# EAGLE design arduino-breadboard (EAGLE 6.6.0)
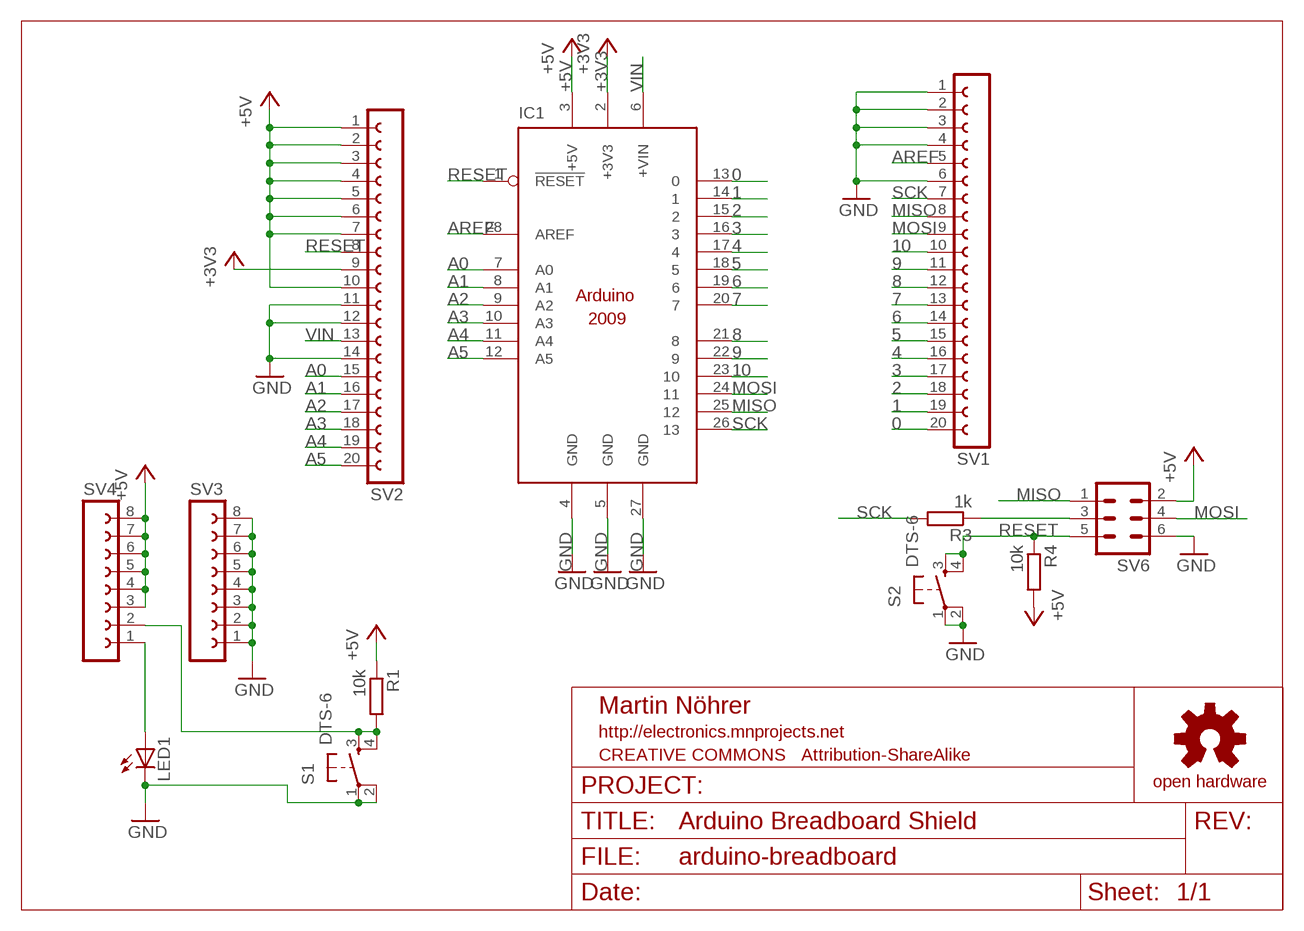
[diagram p0: schematic, sheet 1]

## Parts
IC1  ARDUINO2009_12  [ARDUINO2009_2]
LED1  LED5MM  [LED5MM]
R1  10k  R-EU_0207/10  [0207/10]
R3  1k  R-EU_0207/10  [0207/10]
R4  10k  R-EU_0207/10  [0207/10]
S1  DTS-6  [DTS-6]
S2  DTS-6  [DTS-6]
SV1  FE20-1  [FE20]
SV2  FE20-1  [FE20]
SV3  FE08-1  [FE08]
SV4  FE08-1  [FE08]
SV6  MA03-2  [MA03-2]

## Nets
0: IC1.13 SV1.20
1: IC1.14 SV1.19
2: IC1.15 SV1.18
3: IC1.16 SV1.17
4: IC1.17 SV1.16
5: IC1.18 SV1.15
6: IC1.19 SV1.14
7: IC1.20 SV1.13
8: IC1.21 SV1.12
9: IC1.22 SV1.11
10: IC1.23 SV1.10
+3V3: IC1.2(+3V3) SV2.9
+5V: IC1.3(+5V) R1.1 R4.2 SV2.1 SV2.2 SV2.3 SV2.4 SV2.5 SV2.6 SV2.7 SV2.10 SV4.3 SV4.4 SV4.5 SV4.6 SV4.7 SV4.8 SV6.2
A0: IC1.7(A0) SV2.15
A1: IC1.8(A1) SV2.16
A2: IC1.9(A2) SV2.17
A3: IC1.10(A3) SV2.18
A4: IC1.11(A4) SV2.19
A5: IC1.12(A5) SV2.20
AREF: IC1.28(AREF) SV1.5
GND: IC1.4(GND) IC1.5(GND) IC1.27(GND) LED1.K(C) S1.1 S1.2 S2.1 S2.2 SV1.1 SV1.2 SV1.3 SV1.4 SV1.6 SV2.11 SV2.12 SV2.14 SV3.1 SV3.2 SV3.3 SV3.4 SV3.5 SV3.6 SV3.7 SV3.8 SV6.6
MISO: IC1.25 SV1.8 SV6.1
MOSI: IC1.24 SV1.9 SV6.4
N$1: LED1.A SV4.1
N$4: R3.1 SV6.3
N$7: R1.2 S1.3 S1.4 SV4.2
RESET: IC1.1(!RESET) R4.1 S2.3 S2.4 SV2.8 SV6.5
SCK: IC1.26 R3.2 SV1.7
VIN: IC1.6(+VIN) SV2.13

## Notes on the sheet
- Arduino Breadboard Shield

## Library data of the parts
IC1 = arduino:ARDUINO2009_1: The Arduino Duemilanove ("2009") is a microcontroller board based on the ATmega168 or ATmega328. - 14 digital input/output pins (of which 6 can be used as PWM outputs) - 6 analog inputs, a 16 MHz crystal oscillator - USB connection - power jack - ISP header - reset button It contains everything needed to support the microcontroller; simply connect it to a computer with a USB cable or power it with a AC-to-DC adapter or battery to get started http://arduino.cc/en/Main/ArduinoBoardDuemilanove
LED1 = led:LED: LED OSRAM: - CHIPLED LG R971, LG N971, LY N971, LG Q971, LY Q971, LO R971, LY R971 LH N974, LH R974 LS Q976, LO Q976, LY Q976 LO Q996 - Hyper CHIPLED LW Q18S LB Q993, LB Q99A, LB R99A - SideLED LS A670, LO A670, LY A670, LG A670, LP A670 LB A673, LV A673, LT A673, LW A673 LH A674 LY A675 LS A676, LA A676, LO A676, LY A676, LW A676 LS A679, LY A679, LG A679 - Hyper Micro SIDELED® LS Y876, LA Y876, LO Y876, LY Y876 LT Y87S - SmartLED LW L88C, LW L88S LB L89C, LB L89S, LG L890 LS L89K, LO L89K, LY L89K LS L896, LA L896, LO L896, LY L896 - TOPLED LS T670, LO T670, LY T670, LG T670, LP T670 LSG T670, LSP T670, LSY T670, LOP T670, LYG T670 LG T671, LOG T671, LSG T671 LB T673, LV T673, LT T673, LW T673 LH T674 LS T676, LA T676, LO T676, LY T676, LB T676, LH T676, LSB T676, LW T676 LB T67C, LV T67C, LT T67C, LS T67K, LO T67K, LY T67K, LW E67C LS E67B, LA E67B, LO E67B, LY E67B, LB E67C, LV E67C, LT E67C LW T67C LS T679, LY T679, LG T679 LS T770, LO T770, LY T770, LG T770, LP T770 LB T773, LV T773, LT T773, LW T773 LH T774 LS E675, LA E675, LY E675, LS T675 LS T776, LA T776, LO T776, LY T776, LB T776 LHGB T686 LT T68C, LB T68C - Hyper Mini TOPLED® LB M676 - Mini TOPLED Santana® LG M470 LS M47K, LO M47K, LY M47K Source: http://www.osram.convergy.de LUXEON: - LUMILED® LXK2-PW12-R00, LXK2-PW12-S00, LXK2-PW14-U00, LXK2-PW14-V00 LXK2-PM12-R00, LXK2-PM12-S00, LXK2-PM14-U00 LXK2-PE12-Q00, LXK2-PE12-R00, LXK2-PE12-S00, LXK2-PE14-T00, LXK2-PE14-U00 LXK2-PB12-K00, LXK2-PB12-L00, LXK2-PB12-M00, LXK2-PB14-N00, LXK2-PB14-P00, LXK2-PB14-Q00 LXK2-PR12-L00, LXK2-PR12-M00, LXK2-PR14-Q00, LXK2-PR14-R00 LXK2-PD12-Q00, LXK2-PD12-R00, LXK2-PD12-S00 LXK2-PH12-R00, LXK2-PH12-S00 LXK2-PL12-P00, LXK2-PL12-Q00, LXK2-PL12-R00 Source: www.luxeon.com KINGBRIGHT: KA-3528ASYC Source: www.kingbright.com
R1 R3 R4 = rcl:R-EU_: RESISTOR, European symbol
S1 S2 = switch-tact:DTS-6
SV1 SV2 = con-lsta:FE20-1: FEMALE HEADER
SV3 SV4 = con-lsta:FE08-1: FEMALE HEADER
SV6 = con-lstb:MA03-2: PIN HEADER

## Board
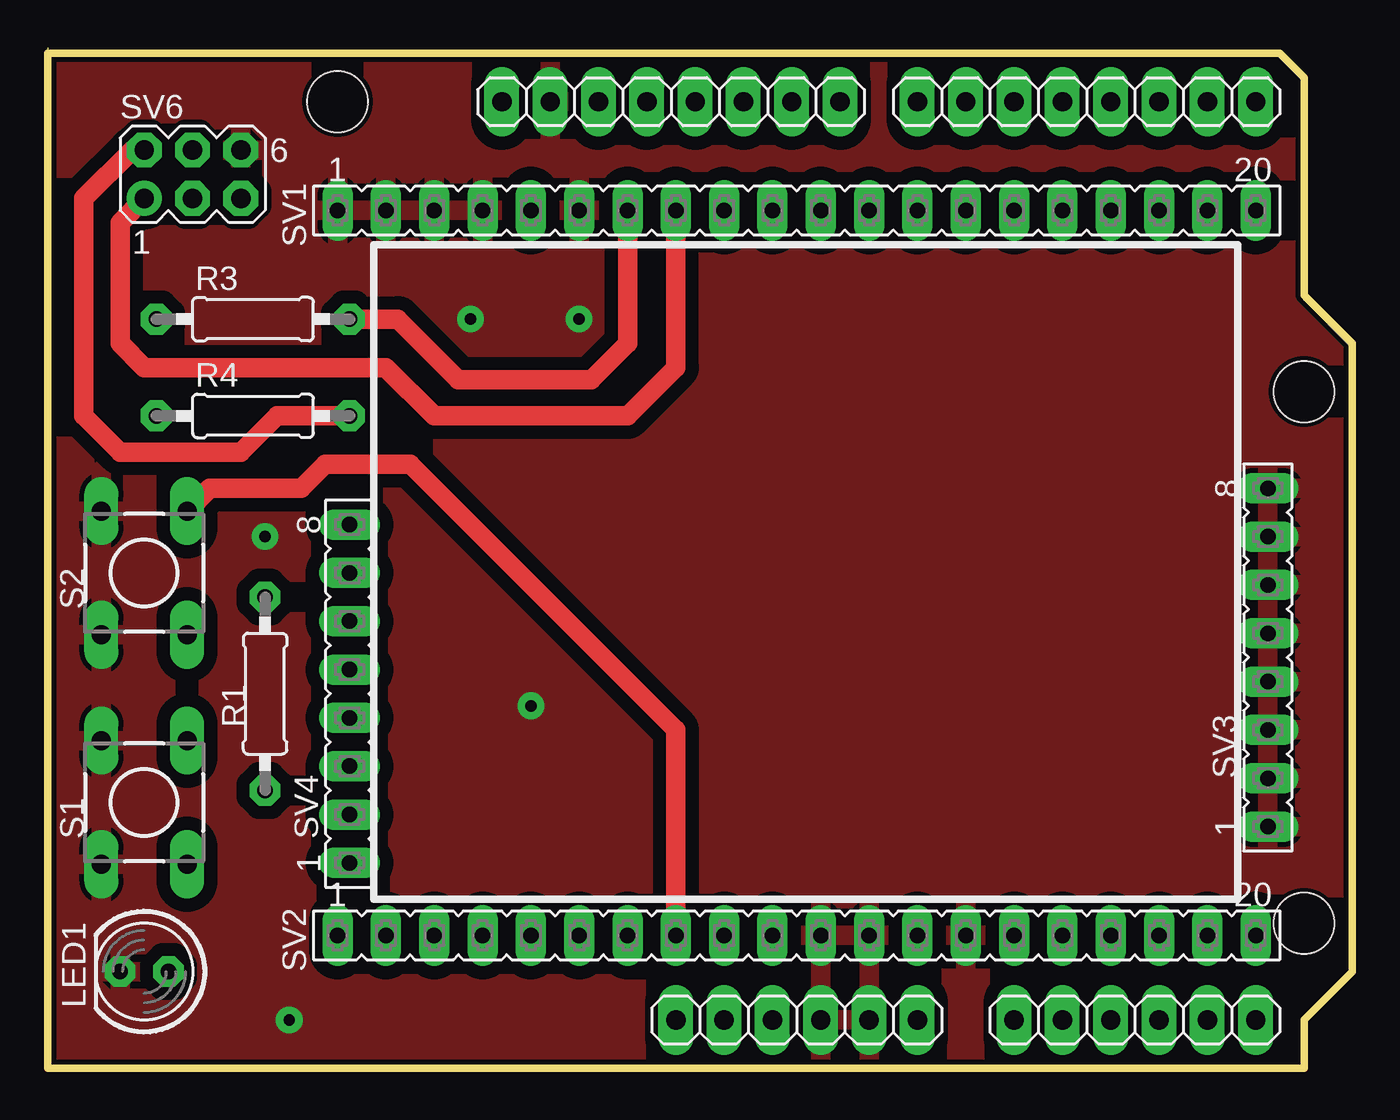
[diagram p1: board, top side]
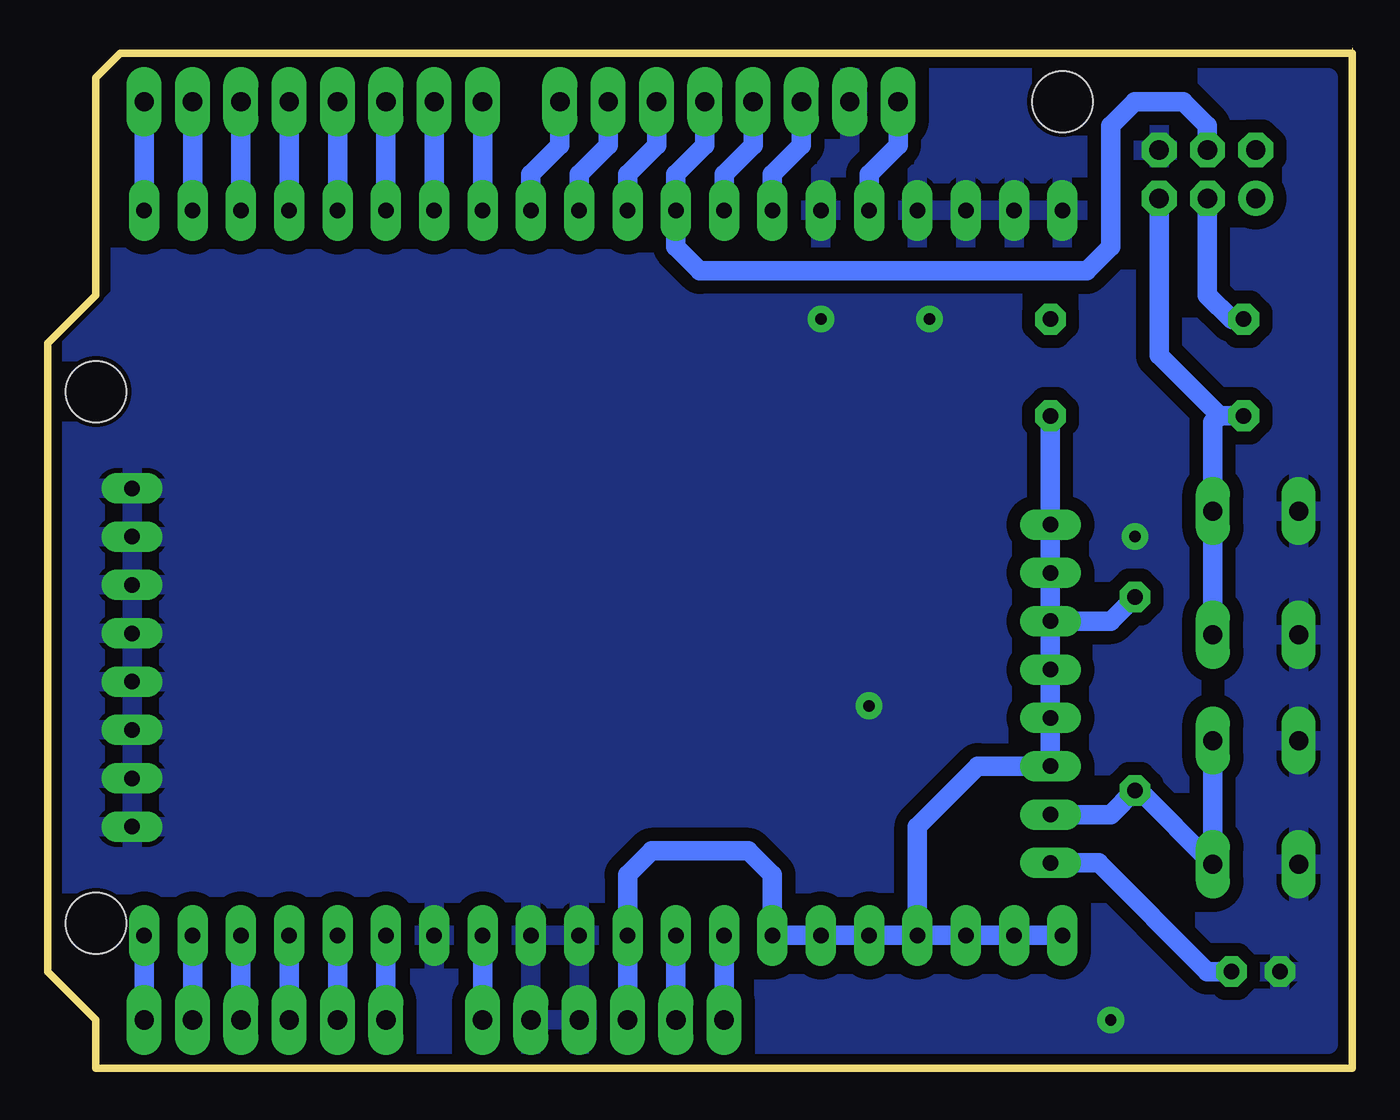
[diagram p2: board, bottom side, seen from below]

Size 68.58 x 53.65 mm. Coordinates in mm from the lower left corner, seen from the top.
Outline: 0,53.65 0,53.34
Outline: 0,53.34 64.77,53.34 66.04,52.07 66.04,40.64 68.58,38.1 68.58,5.08 66.04,2.54 66.04,0 0,0 0,53.34
Copper layers (1*16): Top 0.035mm / dielectric 1.5mm / Bottom 0.035mm
Design rules "hobby2": minimum track width 0.8mm, minimum drill 0.8mm, track to track 0.7mm, track to pad 0.7mm, pad to pad 0.45mm, via to via 0.7mm, smd to smd 8mil, copper to edge 10mil, drill to drill 8mil, minimum pad ring 0.4mm, minimum via ring 0.4mm, stop-mask expansion 0mil, vias tented up to drill 0mil, thermal gap 10mil

### Footprints (pad centres in the part's own frame; a part is rotated, then mirrored left to right if it is on the bottom)
ARDUINO2009_2 = drill 1.016 long: 1 33.02,2.54; 2 35.56,2.54; 3 38.1,2.54; 4 40.64,2.54; 5 43.18,2.54; 6 45.72,2.54; 7 50.8,2.54; 8 53.34,2.54; 9 55.88,2.54; 10 58.42,2.54; 11 60.96,2.54; 12 63.5,2.54; 13 63.5,50.8; 14 60.96,50.8; 15 58.42,50.8; 16 55.88,50.8; 17 53.34,50.8; 18 50.8,50.8; 19 48.26,50.8; 20 45.72,50.8; 21 41.656,50.8; 22 39.116,50.8; 23 36.576,50.8; 24 34.036,50.8; 25 31.496,50.8; 26 28.956,50.8; 27 26.416,50.8; 28 23.876,50.8 | hole 3.2: 15.24,50.8; 66.04,35.56; 66.04,7.62
LED5MM = drill 0.813 octagon: A -1.27,0; K 1.27,0
0207/10 = drill 0.813 octagon: 1 -5.08,0; 2 5.08,0
DTS-6 = drill 1 long: 1 -3.25,2.25; 2 3.25,2.25; 3 -3.25,-2.25; 4 3.25,-2.25
FE20 = drill 0.813 long: 1 -24.13,0; 2 -21.59,0; 3 -19.05,0; 4 -16.51,0; 5 -13.97,0; 6 -11.43,0; 7 -8.89,0; 8 -6.35,0; 9 -3.81,0; 10 -1.27,0; 11 1.27,0; 12 3.81,0; 13 6.35,0; 14 8.89,0; 15 11.43,0; 16 13.97,0; 17 16.51,0; 18 19.05,0; 19 21.59,0; 20 24.13,0
FE08 = drill 0.813 long: 1 -8.89,0; 2 -6.35,0; 3 -3.81,0; 4 -1.27,0; 5 1.27,0; 6 3.81,0; 7 6.35,0; 8 8.89,0
MA03-2 = drill 1.016: 1 -2.54,-1.27 | drill 1.016 octagon: 2 -2.54,1.27; 3 0,-1.27; 4 0,1.27; 5 2.54,-1.27; 6 2.54,1.27

### Placement (x,y rotation side)
IC1  0,0 0 top
LED1  5.08,5.08 180 top
R1  11.43,19.68 270 top
R3  10.79,39.37 0 top
R4  10.79,34.29 0 top
S1  5.08,13.97 90 top
S2  5.08,26.04 90 top
SV1  39.37,45.09 0 top
SV2  39.37,6.99 0 top
SV3  64.14,21.59 90 top
SV4  15.88,19.68 90 top
SV6  7.62,46.99 0 top

### Tracks (layer width: path | path; a pad name or v marks a point on that pad's centre or on a via)
0
  Bottom 1.016: SV1.20 IC1.13
1
  Bottom 1.016: SV1.19 IC1.14
2
  Bottom 1.016: SV1.18 IC1.15
3
  Bottom 1.016: SV1.17 IC1.16
4
  Bottom 1.016: SV1.16 IC1.17
5
  Bottom 1.016: SV1.15 IC1.18
6
  Bottom 1.016: SV1.14 IC1.19
7
  Bottom 1.016: SV1.13 IC1.20
8
  Bottom 1.016: IC1.21 41.66,48.51 43.18,46.99 SV1.12
9
  Bottom 1.016: IC1.22 39.12,48.51 40.64,46.99 SV1.11
10
  Bottom 1.016: IC1.23 36.58,48.51 38.1,46.99 SV1.10
+3V3
  Bottom 1.016: IC1.2 SV2.9
+5V
  Top 1.016: SV6.2 4.45,48.26 1.91,45.72 1.91,34.29 3.81,32.38 10.16,32.38 12.06,34.29 R4.2
  Bottom 1.016: IC1.3 SV2.10 38.1,10.16 36.83,11.43 31.75,11.43 30.48,10.16 SV2.7 SV2.6 SV2.5 SV2.4 | SV2.4 SV2.3 SV2.2 SV2.1 | SV4.6 SV4.5 SV4.4 SV4.3 19.68,15.88 22.86,12.7 SV2.4 | SV4.6 SV4.7 SV4.8 R4.2 | R1.1 12.7,23.5 SV4.6
A0
  Bottom 1.016: IC1.7 SV2.15
A1
  Bottom 1.016: IC1.8 SV2.16
A2
  Bottom 1.016: IC1.9 SV2.17
A3
  Bottom 1.016: IC1.10 SV2.18
A4
  Bottom 1.016: IC1.11 SV2.19
A5
  Bottom 1.016: IC1.12 SV2.20
AREF
  Bottom 1.016: IC1.28 23.88,48.51 25.4,46.99 SV1.5
GND  (via drill 0.6)
  other vias: 12.7,2.54 25.4,19.05 11.43,27.94 22.23,39.37 27.94,39.37
  pour Bottom: 1.27,52.07 64.77,52.07 64.77,40.64 67.31,38.1 67.31,1.27 1.27,1.27
  pour Top: 0,53.34 64.77,53.34 66.04,52.07 66.04,40.64 68.58,38.1 68.58,5.08 66.04,2.54 66.04,0 0,0
MISO
  Top 1.016: SV6.1 3.81,44.45 3.81,38.1 5.08,36.83 17.78,36.83 20.32,34.29 30.48,34.29 33.02,36.83 SV1.8
  Bottom 1.016: SV1.8 33.02,46.99 31.5,48.51 IC1.25
MOSI
  Bottom 1.016: IC1.24 34.04,48.51 35.56,46.99 SV1.9 35.56,43.18 34.29,41.91 13.97,41.91 12.7,43.18 12.7,49.53 11.43,50.8 8.89,50.8 7.62,49.53 SV6.4
N$1
  Bottom 1.016: SV4.1 13.34,10.79 7.62,5.08 LED1.A
N$4
  Bottom 1.016: R3.1 6.35,39.37 7.62,40.64 SV6.3
N$7
  Bottom 1.016: S1.4 S1.3 11.21,14.61 R1.2 12.7,13.34 SV4.2
RESET
  Top 1.016: SV2.8 33.02,17.78 19.05,31.75 14.61,31.75 13.34,30.48 8.53,30.48 S2.4
  Bottom 1.016: SV2.8 IC1.1 | S2.3 S2.4 7.33,33.95 6.99,34.29 | SV6.5 10.16,37.47 6.99,34.29 | 6.99,34.29 R4.1
SCK
  Top 1.016: 30.48,45.72 SV1.7 30.48,38.1 28.57,36.2 21.59,36.2 18.41,39.37 R3.2
  Bottom 1.016: SV1.7 30.48,46.99 28.96,48.51 IC1.26
VIN
  Bottom 1.016: IC1.6 SV2.13

### Text on the board
tPrint: 9 | 8 | 7 | 6 | 5 | 4 | 3 | 2 | 1 | 0 | GND | GND | GND | GND | AREF | GND | 13 | 12 | 11 | 10 | ISP | GND | 5V | RESET | GND | 5V | GND | 5V | GND | 5V | GND | 5V | GND | 5V | GND | TASTER | GND | LED | 5V | 5V | 5V | 5V | 5V | 5V | 5V | RESET | 3.3V | 5V | GND | GND | VIN | GND | A0 | A1 | A2 | A3 | A4 | A5